# EAGLE design ADP1612_5V_OUT (EAGLE 9.6.2)
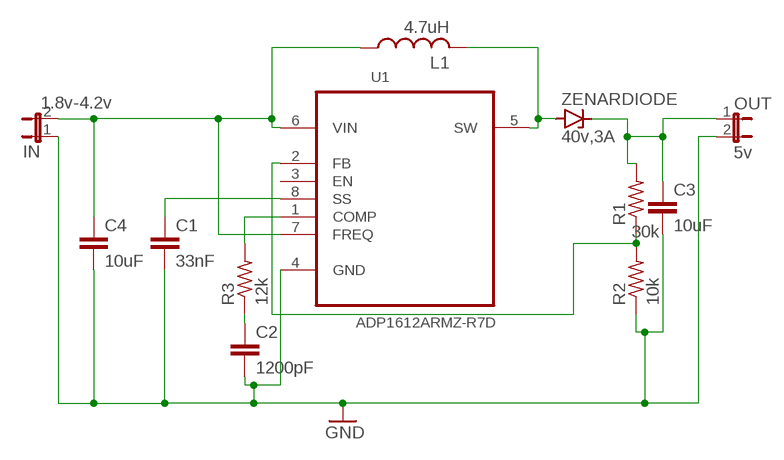
[diagram p0: schematic, sheet 1]

## Parts
C1  33nF  C5/3  [C5B3]
C2  1200pF  C5/3  [C5B3]
C3  10uF  C5/3  [C5B3]
C4  10uF  C5/3  [C5B3]
IN  1.8v-4.2v  JP1E  [JP1]
L1  4.7uH  L-US0207/10  [0207/10]
OUT  5v  JP1E  [JP1]
R1  30k  R-US_0207/7  [0207/7]
R2  10k  R-US_0207/7  [0207/7]
R3  12k  R-US_0207/7  [0207/7]
U1  ADP1612ARMZ-R7D  [SOIC-08]
ZENARDIODE  40v,3A  BZX55  [DO35Z10]

## Nets
GND: C1.2 C2.2 C3.2 C4.2 IN.1 OUT.2 R2.1 U1.4(GND)
N$1: C4.1 IN.2 L1.1 U1.6(VIN) U1.7(FREQ)
N$2: L1.2 U1.5(SW) ZENARDIODE.A
N$3: C3.1 OUT.1 R1.2 ZENARDIODE.C
N$4: C2.1 R3.1
N$5: R1.1 R2.2 U1.2(FB)
N$6: C1.1 U1.8(SS)
N$7: R3.2 U1.1(COMP)
Unconnected: U1.3(EN)

## Library data of the parts
C1-C4 = capacitor-wima:C: CAPACITOR naming: grid - package width
IN OUT = jumper:JP1E: JUMPER
L1 = rcl:L-US: INDUCTOR, American symbol; SPICEPREFIX: L
R1-R3 = rcl:R-US_: RESISTOR, American symbol; SPICEPREFIX: R
U1 = ASP_ADP1612:ADP1612ARMZ-R7: Step-Up PWM DC-to-DC Switching Converters; DESCRIPTION: Boost, SEPIC Switching Regulator IC Positive Adjustable 1.8V 1 Output 1.4A (Switch) 8-TSSOP, 8-MSOP (0.118, 3.00mm Width); DIGI-KEY_PART_NUMBER: ADP1612ARMZ-R7CT-ND; MF: Analog Devices; MP: ADP1612ARMZ-R7; PACKAGE: MSOP-8 Analog Devices; PURCHASE-URL: https://pricing.snapeda.com/search/part/ADP1612ARMZ-R7/?ref=eda
ZENARDIODE = diode:BZX55: Z DIODE

## Board
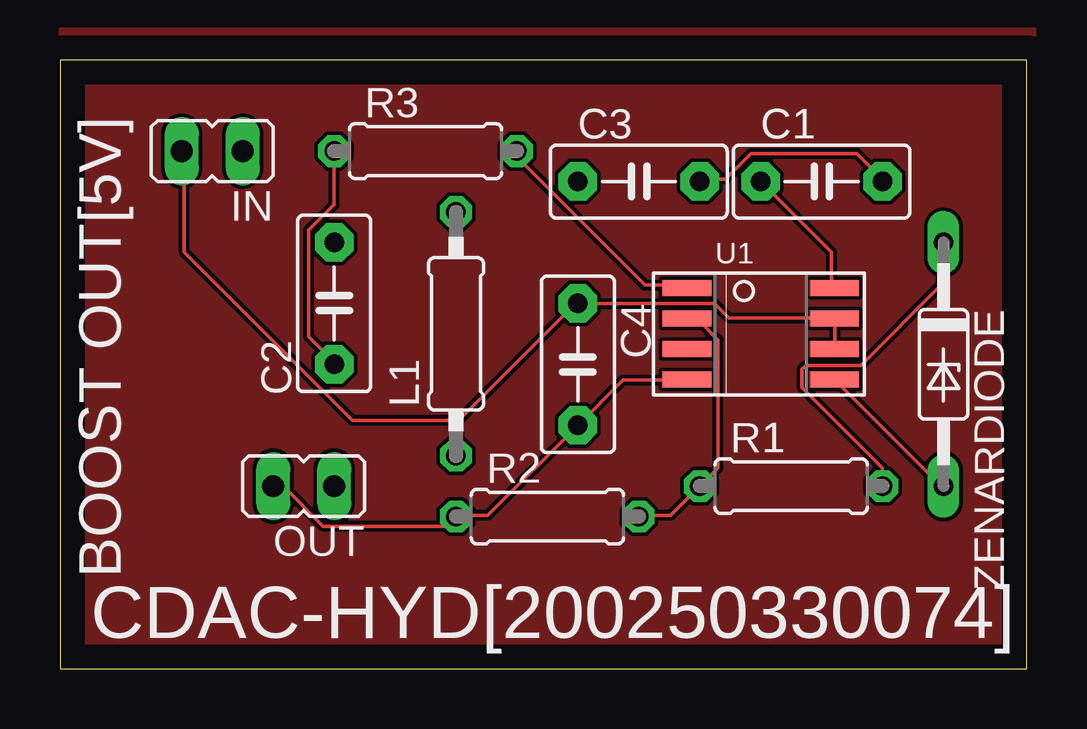
[diagram p1: board, top side]
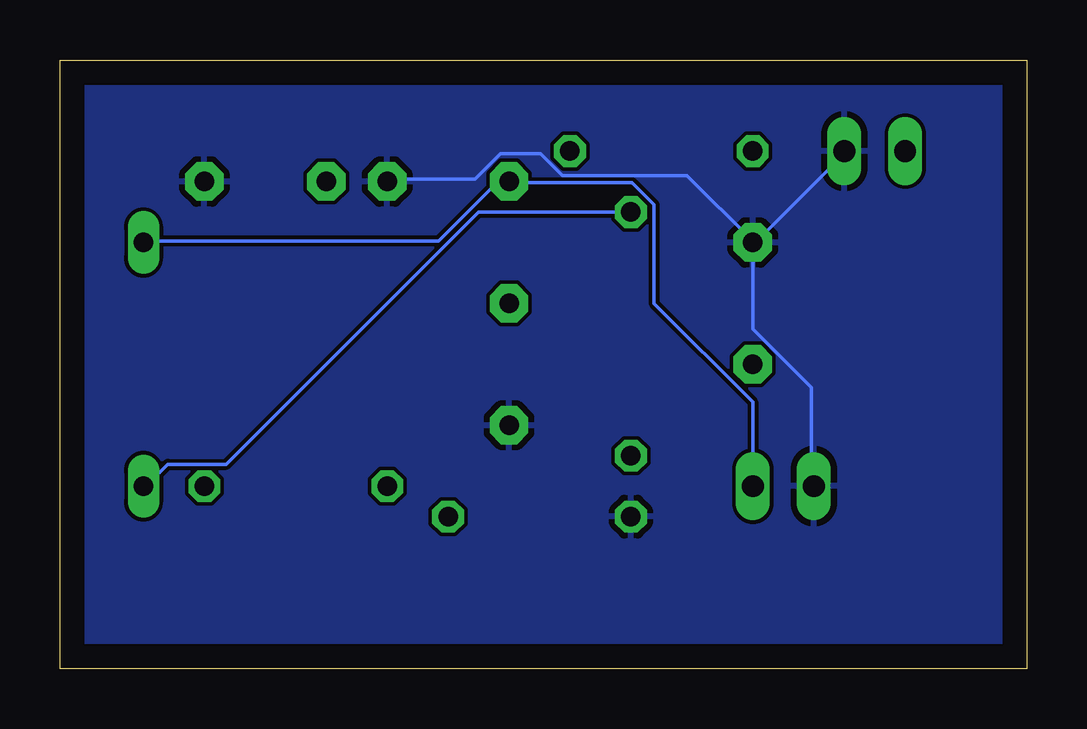
[diagram p2: board, bottom side, seen from below]

Size 40.31 x 25.39 mm. Coordinates in mm from the lower left corner, seen from the top.
Outline: 0,0 40.31,0 40.31,25.39 0,25.39 0,0
Copper layers (1*16): Top 0.035mm / dielectric 1.5mm / Bottom 0.035mm
Design rules "default": minimum track width 6mil, minimum drill 0.35mm, track to track 6mil, track to pad 6mil, pad to pad 6mil, via to via 6mil, smd to smd 6mil, copper to edge 40mil, drill to drill 6mil, minimum pad ring 10mil, minimum via ring 8mil, stop-mask expansion 4mil, vias tented up to drill 0mil, thermal gap 10mil

### Footprints (pad centres in the part's own frame; a part is rotated, then mirrored left to right if it is on the bottom)
C5B3 = drill 0.813 pad 1.6 octagon: 1 -2.54,0; 2 2.54,0
JP1 = drill 0.914 long: 1 0,-1.27; 2 0,1.27
0207/10 = drill 0.813 octagon: 1 -5.08,0; 2 5.08,0
0207/7 = drill 0.813 octagon: 1 -3.81,0; 2 3.81,0
SOIC-08 = smd 0.66 x 2.032: 1 -1.905,-3.073; 2 -0.635,-3.073; 3 0.635,-3.073; 4 1.905,-3.073; 5 1.905,3.073; 6 0.635,3.073; 7 -0.635,3.073; 8 -1.905,3.073
DO35Z10 = drill 0.813 long: A 5.08,0; C -5.08,0

### Placement (x,y rotation side)
C1  31.75,20.32 0 top
C2  11.43,15.24 90 top
C3  24.13,20.32 0 top
C4  21.59,12.7 270 top
IN  6.35,21.59 90 top
L1  16.51,13.97 90 top
OUT  10.16,7.62 90 top
R1  30.48,7.62 0 top
R2  20.32,6.35 0 top
R3  15.24,21.59 0 top
U1  29.21,13.97 270 top
ZENARDIODE  36.83,12.7 270 top

### Tracks (layer width: path | path; a pad name or v marks a point on that pad's centre or on a via)
GND
  Top 0.152: C3.2 26.67,20.42 27.74,20.42 28.8,21.49 33.22,21.49 34.29,20.42 C1.2 | U1.4 26.06,12.04 23.47,12.04 C4.2 17.83,6.4 16.61,6.4 R2.1 16.46,6.25 16.15,5.94 10.97,5.94 9.3,7.62 OUT.2
  Bottom 0.152: 11.43,17.68 7.62,21.49 IN.1 | 11.43,17.68 11.43,14.17 8.99,11.73 8.99,7.62 OUT.2 | 11.43,17.68 C2.2 11.43,17.83 14.17,20.57 19.36,20.57 20.27,21.49 21.95,21.49 23.01,20.42 26.67,20.42 C3.2
  pour Bottom: -1.27,27.94 41.91,27.94 41.91,-1.27 -1.27,-1.27
N$1
  Top 0.152: U1.6 32.31,13.41 32.31,14.48 U1.7 32.16,14.63 27.89,14.63 27.28,15.24 C4.1 21.49,15.24 16.61,10.36 | 16.61,10.36 16.61,8.99 L1.1 | 16.61,10.36 12.19,10.36 5.18,17.37 5.18,21.49 IN.2
N$2
  Top 0.152: U1.5 36.73,7.62 ZENARDIODE.A
  Bottom 0.152: L1.2 22.86,19.05 33.38,8.53 35.81,8.53 36.73,7.62 ZENARDIODE.A
N$3
  Top 0.152: R1.2 34.29,8.38 30.94,11.73 30.94,12.5 31.09,12.65 33.38,12.65 36.73,16 36.73,17.68 ZENARDIODE.C
  Bottom 0.152: OUT.1 11.43,11.12 15.54,15.24 15.54,19.36 16.46,20.27 21.49,20.27 C3.1 21.64,20.27 22.1,20.27 24.54,17.83 36.73,17.83 ZENARDIODE.C
N$4
  Top 0.152: R3.1 11.43,19.36 10.36,18.29 10.36,13.87 11.43,12.8 C2.1
N$5
  Top 0.152: U1.2 26.21,14.48 26.67,14.48 27.43,13.72 27.43,8.38 R1.1 25.45,6.4 24.23,6.4 R2.2
N$6
  Top 0.152: C1.1 32.16,17.37 32.16,16 U1.8
N$7
  Top 0.152: R3.2 19.05,21.34 24.38,16 26.06,16 U1.1
TOP
  pour Top: 0,26.67 40.64,26.67 40.64,0 0,0

### Text on the board
tPlace: BOOST OUT[5V] | CDAC-HYD[200250330074]